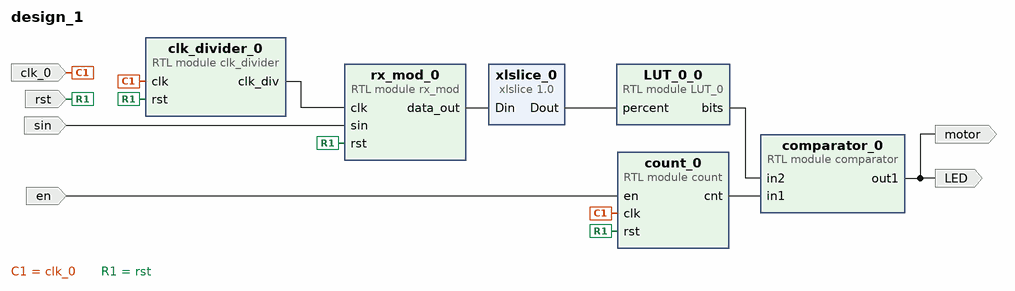
[diagram p0: block diagram of the top level]
# Vivado block design design_1, xc7z020clg400-1, Vivado 2020.2
create_bd_design design_1

create_bd_port -dir I -type clk clk_0
create_bd_port -dir I -type rst rst
create_bd_port -dir I sin
create_bd_port -dir I en
create_bd_port -dir O LED
create_bd_port -dir O motor

create_bd_cell -type module -reference clk_divider clk_divider_0
create_bd_cell -type module -reference rx_mod rx_mod_0
create_bd_cell -type module -reference comparator comparator_0
set_property -dict {CONFIG.n_bits 27} [get_bd_cells comparator_0]
create_bd_cell -type module -reference count count_0
set_property -dict {CONFIG.n_bits 27} [get_bd_cells count_0]
create_bd_cell -type ip -vlnv xilinx.com:ip:xlslice:1.0 xlslice_0
set_property -dict {CONFIG.DIN_FROM 3 CONFIG.DIN_TO 0 CONFIG.DIN_WIDTH 8 CONFIG.DOUT_WIDTH 4} [get_bd_cells xlslice_0]
create_bd_cell -type module -reference LUT_0 LUT_0_0

# ---- connections ----

connect_bd_net -net clk_0_1 [get_bd_ports clk_0] [get_bd_pins clk_divider_0/clk] [get_bd_pins count_0/clk]
connect_bd_net [get_bd_pins clk_divider_0/clk_div] [get_bd_pins rx_mod_0/clk]
connect_bd_net [get_bd_pins rx_mod_0/data_out] [get_bd_pins xlslice_0/Din]
connect_bd_net [get_bd_pins count_0/cnt] [get_bd_pins comparator_0/in1]
connect_bd_net -net rst_0_1 [get_bd_ports rst] [get_bd_pins clk_divider_0/rst] [get_bd_pins count_0/rst] [get_bd_pins rx_mod_0/rst]
connect_bd_net -net sin_0_1 [get_bd_ports sin] [get_bd_pins rx_mod_0/sin]
connect_bd_net -net en_0_1 [get_bd_ports en] [get_bd_pins count_0/en]
connect_bd_net [get_bd_pins comparator_0/out1] [get_bd_ports LED] [get_bd_ports motor]
connect_bd_net [get_bd_pins xlslice_0/Dout] [get_bd_pins LUT_0_0/percent]
connect_bd_net [get_bd_pins LUT_0_0/bits] [get_bd_pins comparator_0/in2]

validate_bd_design
save_bd_design
